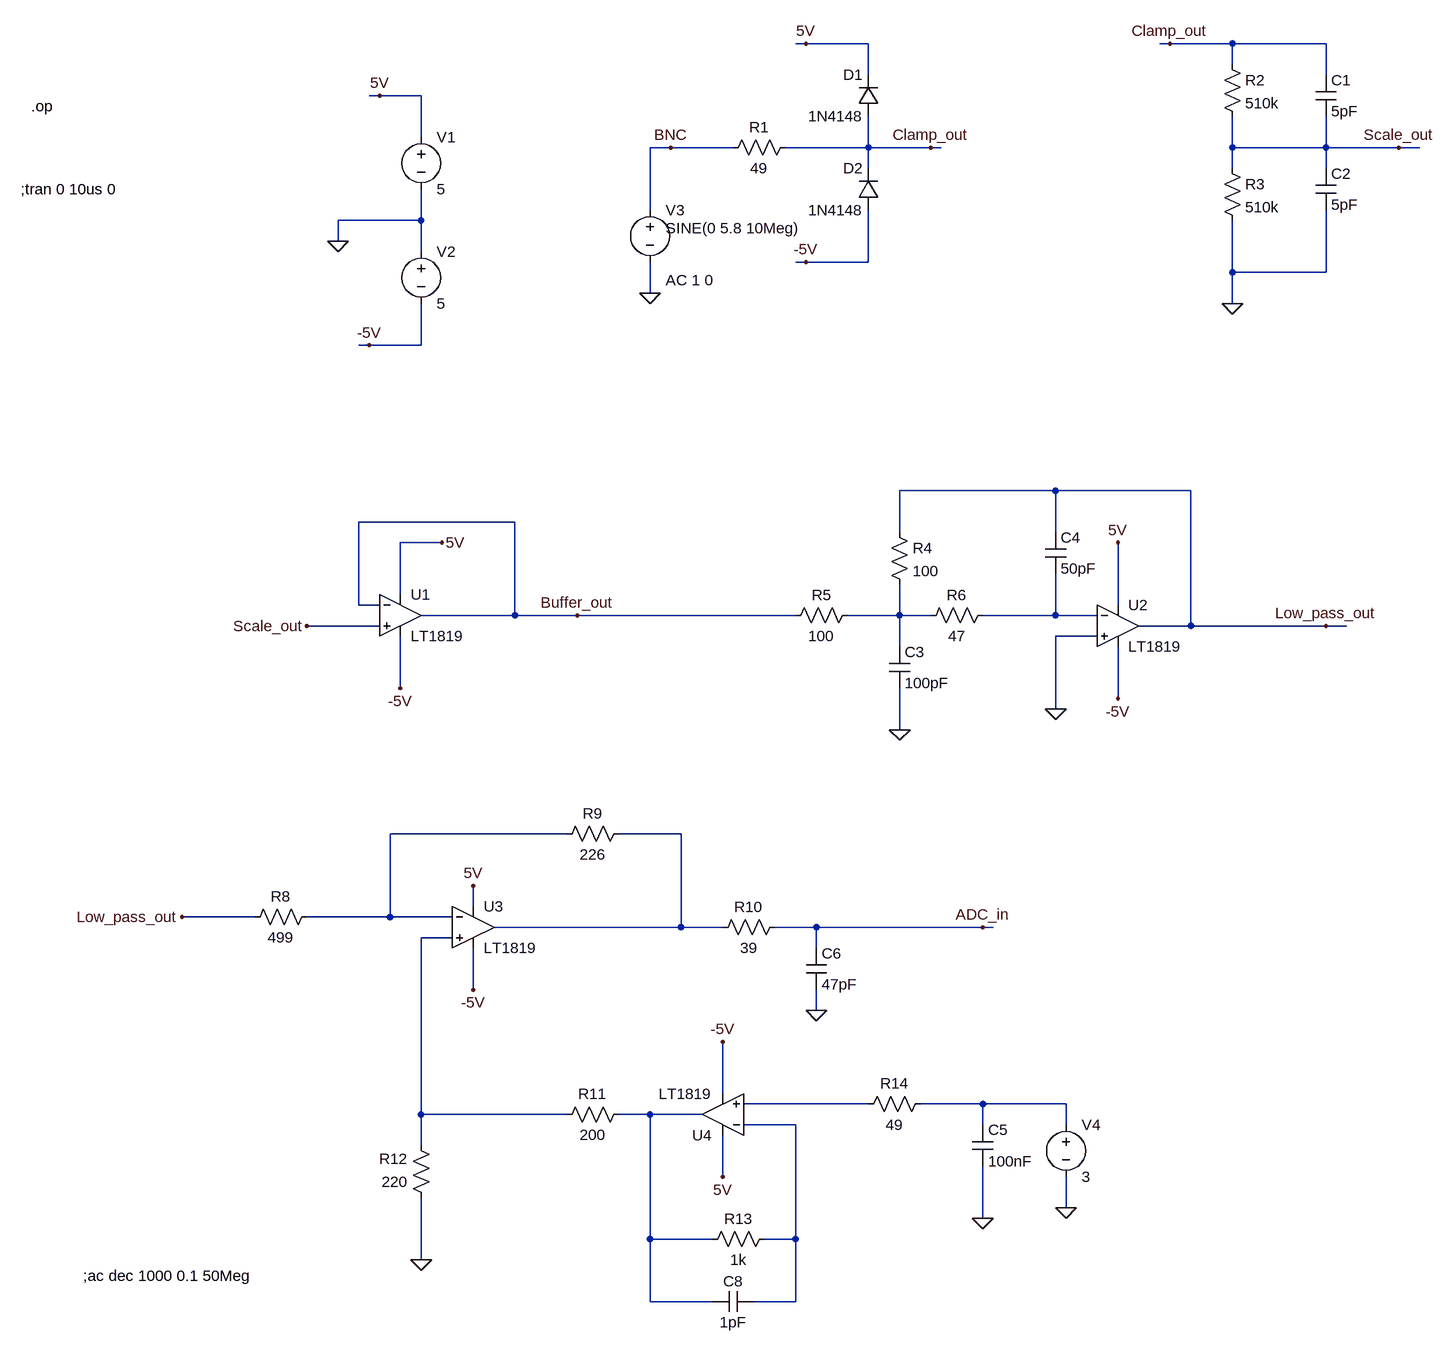
[diagram p0: schematic front_end.asc]
front_end.asc, the LTspice schematic file:
Version 4
SHEET 1 1496 1904
WIRE 512 -80 496 -80
WIRE 608 -80 512 -80
WIRE 1072 -80 1056 -80
WIRE 1168 -80 1072 -80
WIRE 1312 -80 1168 -80
WIRE 1168 -48 1168 -80
WIRE 608 -32 608 -80
WIRE 1312 -32 1312 -80
WIRE -144 0 -160 0
WIRE -80 0 -144 0
WIRE -80 64 -80 0
WIRE 304 80 272 80
WIRE 400 80 304 80
WIRE 608 80 608 32
WIRE 608 80 480 80
WIRE 704 80 608 80
WIRE 720 80 704 80
WIRE 1168 80 1168 32
WIRE 1312 80 1312 32
WIRE 1312 80 1168 80
WIRE 1424 80 1312 80
WIRE 1456 80 1424 80
WIRE 608 112 608 80
WIRE 1168 112 1168 80
WIRE 1312 112 1312 80
WIRE 272 176 272 80
WIRE -80 192 -80 144
WIRE -80 192 -208 192
WIRE -208 224 -208 192
WIRE -80 240 -80 192
WIRE 512 256 496 256
WIRE 608 256 608 176
WIRE 608 256 512 256
WIRE 1168 272 1168 192
WIRE 1312 272 1312 176
WIRE 1312 272 1168 272
WIRE 272 304 272 256
WIRE 1168 320 1168 272
WIRE -160 384 -176 384
WIRE -80 384 -80 320
WIRE -80 384 -160 384
WIRE 896 608 656 608
WIRE 1104 608 896 608
WIRE 64 656 -176 656
WIRE 656 672 656 608
WIRE 896 672 896 608
WIRE -48 688 -112 688
WIRE -112 768 -112 688
WIRE -176 784 -176 656
WIRE -144 784 -176 784
WIRE 992 784 992 688
WIRE 64 800 64 656
WIRE 64 800 -80 800
WIRE 160 800 64 800
WIRE 496 800 160 800
WIRE 656 800 656 752
WIRE 656 800 576 800
WIRE 704 800 656 800
WIRE 896 800 896 736
WIRE 896 800 784 800
WIRE 960 800 896 800
WIRE -144 816 -256 816
WIRE 1104 816 1104 608
WIRE 1104 816 1024 816
WIRE 1312 816 1104 816
WIRE 1344 816 1312 816
WIRE 960 832 896 832
WIRE 656 848 656 800
WIRE -112 912 -112 832
WIRE 992 928 992 848
WIRE 896 944 896 832
WIRE 656 976 656 912
WIRE 144 1136 -128 1136
WIRE 320 1136 224 1136
WIRE 0 1248 0 1216
WIRE -336 1264 -448 1264
WIRE -128 1264 -128 1136
WIRE -128 1264 -256 1264
WIRE -32 1264 -128 1264
WIRE 320 1280 320 1136
WIRE 320 1280 32 1280
WIRE 384 1280 320 1280
WIRE 528 1280 464 1280
WIRE 784 1280 528 1280
WIRE 800 1280 784 1280
WIRE -32 1296 -80 1296
WIRE 528 1312 528 1280
WIRE 0 1376 0 1312
WIRE 528 1408 528 1376
WIRE 384 1536 384 1456
WIRE 608 1552 416 1552
WIRE 784 1552 688 1552
WIRE 912 1552 784 1552
WIRE -80 1568 -80 1296
WIRE 144 1568 -80 1568
WIRE 272 1568 224 1568
WIRE 352 1568 272 1568
WIRE 496 1584 416 1584
WIRE 784 1584 784 1552
WIRE 912 1584 912 1552
WIRE -80 1616 -80 1568
WIRE 384 1664 384 1600
WIRE 912 1712 912 1664
WIRE 784 1728 784 1648
WIRE 272 1760 272 1568
WIRE 368 1760 272 1760
WIRE 496 1760 496 1584
WIRE 496 1760 448 1760
WIRE -80 1792 -80 1696
WIRE 272 1856 272 1760
WIRE 368 1856 272 1856
WIRE 496 1856 496 1760
WIRE 496 1856 432 1856
FLAG -208 224 0
FLAG -160 384 -5V
FLAG -144 0 5V
FLAG 272 304 0
FLAG 512 -80 5V
FLAG 512 256 -5V
FLAG 304 80 BNC
FLAG 704 80 Clamp_out
FLAG 1168 320 0
FLAG 1072 -80 Clamp_out
FLAG 1424 80 Scale_out
FLAG 160 800 Buffer_out
FLAG 992 688 5V
FLAG 992 928 -5V
FLAG 656 976 0
FLAG 528 1408 0
FLAG -80 1792 0
FLAG 784 1728 0
FLAG 0 1216 5V
FLAG 384 1456 -5V
FLAG 384 1664 5V
FLAG 912 1712 0
FLAG 1312 816 Low_pass_out
FLAG 784 1280 ADC_in
FLAG 896 944 0
FLAG -48 688 5V
FLAG -112 912 -5V
FLAG -256 816 Scale_out
FLAG -448 1264 Low_pass_out
FLAG 0 1376 -5V
DATAFLAG -32 800 ""
DATAFLAG -112 736 ""
DATAFLAG -176 816 ""
DATAFLAG 512 80 ""
SYMBOL voltage -80 48 R0
SYMATTR InstName V1
SYMATTR Value 5
SYMBOL voltage -80 224 R0
SYMATTR InstName V2
SYMATTR Value 5
SYMBOL voltage 272 160 R0
WINDOW 123 24 124 Left 2
WINDOW 39 0 0 Left 2
WINDOW 3 24 44 Left 2
SYMATTR Value2 AC 1 0
SYMATTR Value SINE(0 5.8 10Meg)
SYMATTR InstName V3
SYMBOL res 496 64 R90
WINDOW 0 0 56 VBottom 2
WINDOW 3 32 56 VTop 2
SYMATTR InstName R1
SYMATTR Value 49
SYMBOL diode 624 32 R180
WINDOW 0 24 64 Left 2
WINDOW 3 24 0 Left 2
SYMATTR InstName D1
SYMATTR Value 1N4148
SYMBOL diode 624 176 R180
WINDOW 0 24 64 Left 2
WINDOW 3 24 0 Left 2
SYMATTR InstName D2
SYMATTR Value 1N4148
SYMBOL res 1152 -64 R0
SYMATTR InstName R2
SYMATTR Value 510k
SYMBOL res 1152 96 R0
SYMATTR InstName R3
SYMATTR Value 510k
SYMBOL cap 1296 -32 R0
SYMATTR InstName C1
SYMATTR Value 5pF
SYMBOL cap 1296 112 R0
SYMATTR InstName C2
SYMATTR Value 5pF
SYMBOL Opamps\\LT1819 -112 800 R0
SYMATTR InstName U1
SYMBOL res 640 656 R0
SYMATTR InstName R4
SYMATTR Value 100
SYMBOL res 592 784 R90
WINDOW 0 0 56 VBottom 2
WINDOW 3 32 56 VTop 2
SYMATTR InstName R5
SYMATTR Value 100
SYMBOL res 800 784 R90
WINDOW 0 0 56 VBottom 2
WINDOW 3 32 56 VTop 2
SYMATTR InstName R6
SYMATTR Value 47
SYMBOL cap 640 848 R0
SYMATTR InstName C3
SYMATTR Value 100pF
SYMBOL cap 880 672 R0
SYMATTR InstName C4
SYMATTR Value 50pF
SYMBOL Opamps\\LT1819 992 816 R0
SYMATTR InstName U2
SYMBOL Opamps\\LT1819 0 1280 R0
SYMATTR InstName U3
SYMBOL Opamps\\LT1819 384 1568 R180
SYMATTR InstName U4
SYMBOL res -240 1248 R90
WINDOW 0 0 56 VBottom 2
WINDOW 3 32 56 VTop 2
SYMATTR InstName R8
SYMATTR Value 499
SYMBOL res 240 1120 R90
WINDOW 0 0 56 VBottom 2
WINDOW 3 32 56 VTop 2
SYMATTR InstName R9
SYMATTR Value 226
SYMBOL res 480 1264 R90
WINDOW 0 0 56 VBottom 2
WINDOW 3 32 56 VTop 2
SYMATTR InstName R10
SYMATTR Value 39
SYMBOL res 240 1552 R90
WINDOW 0 0 56 VBottom 2
WINDOW 3 32 56 VTop 2
SYMATTR InstName R11
SYMATTR Value 200
SYMBOL res -64 1712 R180
WINDOW 0 36 76 Left 2
WINDOW 3 36 40 Left 2
SYMATTR InstName R12
SYMATTR Value 220
SYMBOL res 352 1776 R270
WINDOW 0 32 56 VTop 2
WINDOW 3 0 56 VBottom 2
SYMATTR InstName R13
SYMATTR Value 1k
SYMBOL res 592 1568 R270
WINDOW 0 32 56 VTop 2
WINDOW 3 0 56 VBottom 2
SYMATTR InstName R14
SYMATTR Value 49
SYMBOL cap 768 1584 R0
SYMATTR InstName C5
SYMATTR Value 100nF
SYMBOL cap 512 1312 R0
SYMATTR InstName C6
SYMATTR Value 47pF
SYMBOL voltage 912 1568 R0
SYMATTR InstName V4
SYMATTR Value 3
SYMBOL cap 432 1840 R90
WINDOW 0 0 32 VBottom 2
WINDOW 3 32 32 VTop 2
SYMATTR InstName C8
SYMATTR Value 1pF
TEXT -600 1816 Left 2 !;ac dec 1000 0.1 50Meg
TEXT -696 144 Left 2 !;tran 0 10us 0
TEXT -680 16 Left 2 !.op

The netlist it stands for:
* front_end.asc
V1 5V 0 5
V2 0 -5V 5
V3 BNC 0 SINE(0 5.8 10Meg) AC 1 0
R1 Clamp_out BNC 49
D1 Clamp_out 5V 1N4148
D2 -5V Clamp_out 1N4148
R2 Clamp_out Scale_out 510k
R3 Scale_out 0 510k
C1 Clamp_out Scale_out 5pF
C2 Scale_out 0 5pF
* U1: LT1819 (symbol Opamps\LT1819 not available, pins judged from their places): In+=Scale_out In-=Buffer_out V+=5V V-=-5V OUT=Buffer_out
R4 Low_pass_out N001 100
R5 N001 Buffer_out 100
R6 N002 N001 47
C3 N001 0 100pF
C4 Low_pass_out N002 50pF
* U2: LT1819 (symbol Opamps\LT1819 not available, pins judged from their places): In+=0 In-=N002 V+=5V V-=-5V OUT=Low_pass_out
* U3: LT1819 (symbol Opamps\LT1819 not available, pins judged from their places): In+=N005 In-=N003 V+=5V V-=-5V OUT=N004
* U4: LT1819 (symbol Opamps\LT1819 not available, pins judged from their places): In+=N006 In-=N009 V+=5V V-=-5V OUT=N008
R8 N003 Low_pass_out 499
R9 N004 N003 226
R10 ADC_in N004 39
R11 N008 N005 200
R12 0 N005 220
R13 N008 N009 1k
R14 N006 N007 49
C5 N007 0 100nF
C6 ADC_in 0 47pF
V4 N007 0 3
C8 N009 N008 1pF
.model D D
.lib standard.dio
;ac dec 1000 0.1 50Meg
;tran 0 10us 0
.op
.backanno
.end